# EAGLE design breakout_v3 (EAGLE 9.2.2)
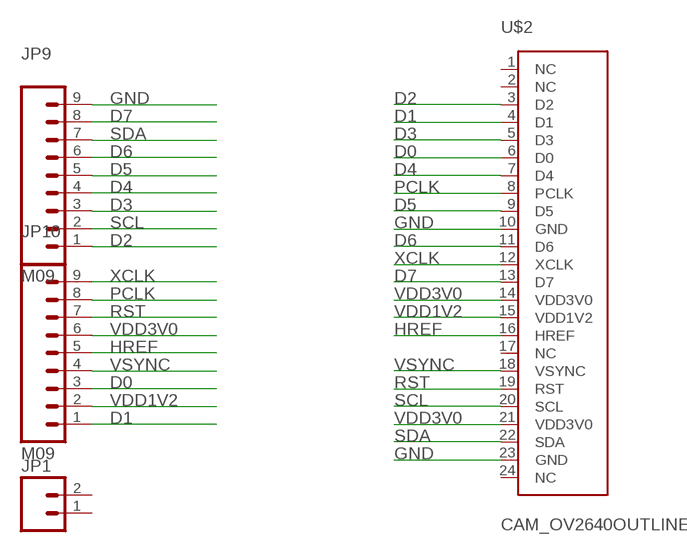
[diagram p0: schematic, sheet 1]

## Parts
JP1  M02PTH  [1X02]
JP9  M09  [1X09]
JP10  M09  [1X09]
U$2  CAM_OV2640OUTLINE  [CAM_CONN]

## Nets
D0: JP10.3 U$2.6(D0)
D1: JP10.1 U$2.4(D1)
D2: JP9.1 U$2.3(D2)
D3: JP9.3 U$2.5(D3)
D4: JP9.4 U$2.7(D4)
D5: JP9.5 U$2.9(D5)
D6: JP9.6 U$2.11(D6)
D7: JP9.8 U$2.13(D7)
GND: JP9.9 U$2.10(GND) U$2.23(GND)
HREF: JP10.5 U$2.16(HREF)
PCLK: JP10.8 U$2.8(PCLK)
RST: JP10.7 U$2.19(RST)
SCL: JP9.2 U$2.20(SCL)
SDA: JP9.7 U$2.22(SDA)
VDD1V2: JP10.2 U$2.15(VDD1V2)
VDD3V0: JP10.6 U$2.14(VDD3V0) U$2.21(VDD3V0)
VSYNC: JP10.4 U$2.18(VSYNC)
XCLK: JP10.9 U$2.12(XCLK)
Unconnected: JP1.1 JP1.2 U$2.1(NC) U$2.2(NC) U$2.17(NC) U$2.24(NC)

## Library data of the parts
JP1 = SparkFun:M02: Header 2 Standard 2-pin 0.1" header. Use with straight break away headers (SKU : PRT-00116), right angle break away headers (PRT-00553), swiss pins (PRT-00743), machine pins (PRT-00117), and female headers (PRT-00115). Molex polarized connector foot print use with SKU : PRT-08233 with associated crimp pins and housings.
JP9 JP10 = SparkFun:M09: Header 9 Standard 9-pin 0.1" header. Use with straight break away headers (SKU : PRT-00116), right angle break away headers (PRT-00553), swiss pins (PRT-00743), machine pins (PRT-00117), and female headers (PRT-00115).
U$2 = Ilya_Teach:CAM_OV2640

## Board
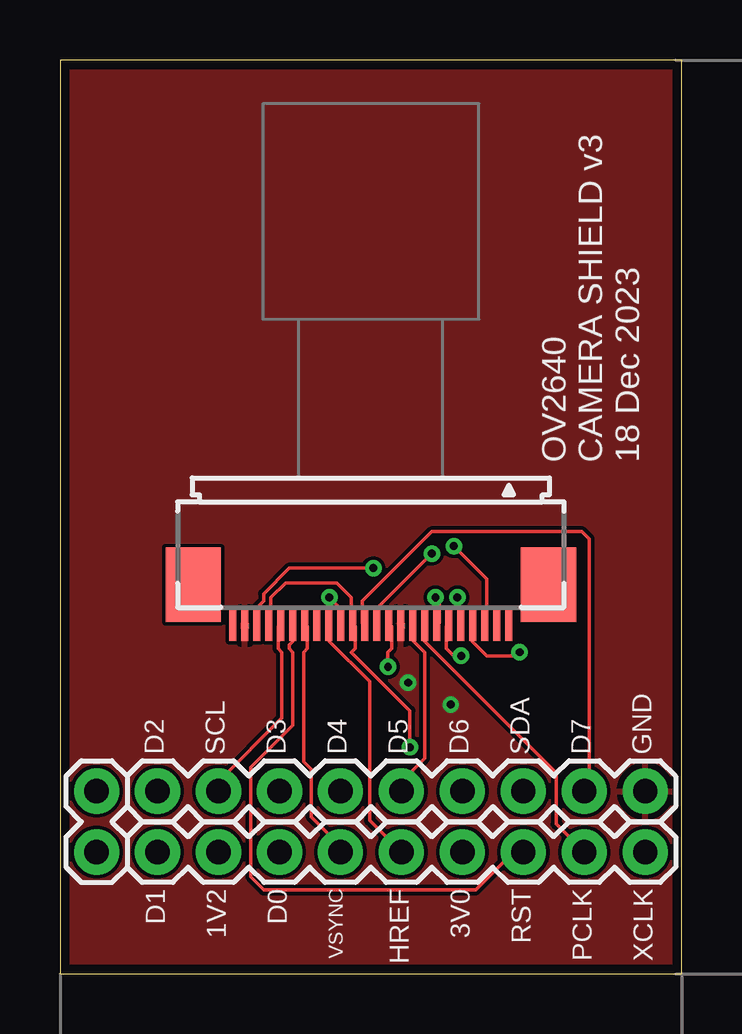
[diagram p1: board, top side]
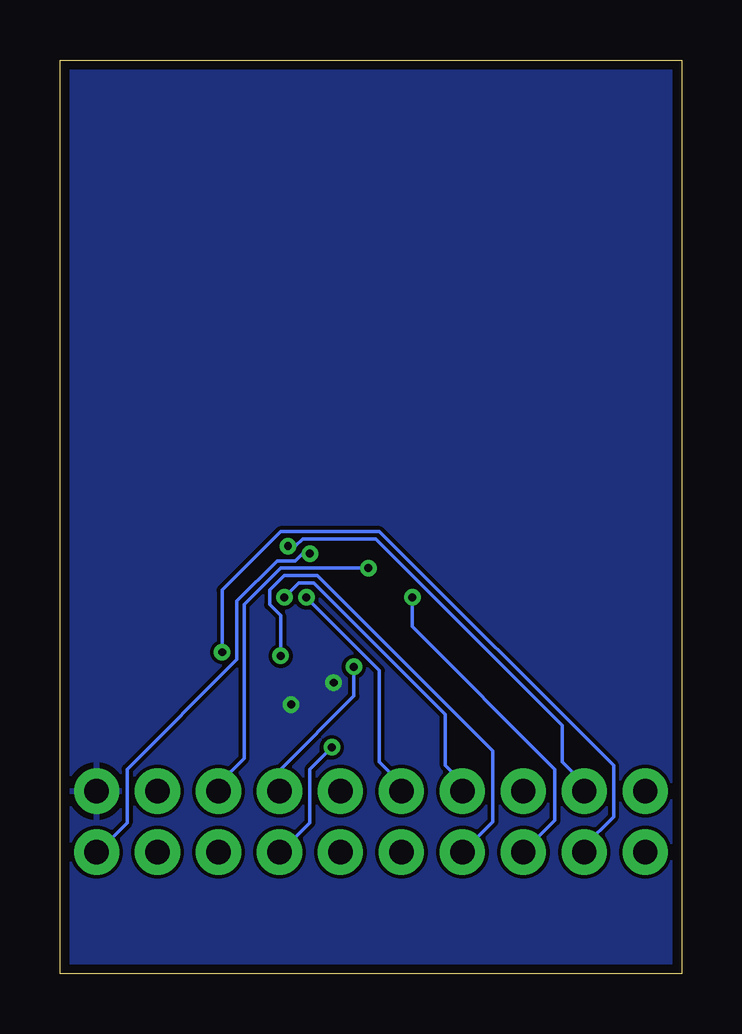
[diagram p2: board, bottom side, seen from below]

Size 25.91 x 38.1 mm. Coordinates in mm from the lower left corner, seen from the top.
Outline: 0,0 25.91,0 25.91,38.1 0,38.1 0,0
Copper layers (1*16): Top 0.0356mm / dielectric 1.5011mm / Bottom 0.0356mm
Design rules "LaenPCBOrder": minimum track width 6mil, minimum drill 13mil, track to track 6mil, track to pad 6mil, pad to pad 6mil, via to via 6mil, smd to smd 6mil, copper to edge 15mil, drill to drill 6mil, minimum pad ring 7mil, minimum via ring 7mil, stop-mask expansion 4mil, vias tented up to drill 0mil, thermal gap 10mil

### Footprints (pad centres in the part's own frame; a part is rotated, then mirrored left to right if it is on the bottom)
1X02 = drill 1.016 pad 1.88: 1 0,0; 2 2.54,0
1X09 = drill 1.016 pad 1.88: 1 0,0; 2 2.54,0; 3 5.08,0; 4 7.62,0; 5 10.16,0; 6 12.7,0; 7 15.24,0; 8 17.78,0; 9 20.32,0
CAM_CONN = smd 0.3 x 1.3: 1 -5.75,3.25; 2 -5.25,3.25; 3 -4.75,3.25; 4 -4.25,3.25; 5 -3.75,3.25; 6 -3.25,3.25; 7 -2.75,3.25; 8 -2.25,3.25; 9 -1.75,3.25; 10 -1.25,3.25; 11 -0.75,3.25; 12 -0.25,3.25; 13 0.25,3.25; 14 0.75,3.25; 15 1.25,3.25; 16 1.75,3.25; 17 2.25,3.25; 18 2.75,3.25; 19 3.25,3.25; 20 3.75,3.25; 21 4.25,3.25; 22 4.75,3.25; 23 5.25,3.25; 24 5.75,3.25 | smd 2.3 x 3.1: P1 -7.4,1.55; P2 7.4,1.55

### Placement (x,y rotation side)
JP1  1.52,5.08 90 top
JP9  4.06,7.62 0 top
JP10  4.06,5.08 0 top
U$2  12.95,17.78 180 top

### Tracks (layer width: path | path; a pad name or v marks a point on that pad's centre or on a via)
D0  (via drill 0.33)
  Top 0.152: v16.71,13.26 16.41,13.26 16.1,13.56 16.1,14.48 U$2.6
  Bottom 0.152: v16.71,13.26 16.71,14.94 17.17,15.39 17.17,16 16.56,16.61 15.19,16.61 7.87,9.3 7.87,6.35 JP10.3
D1  (via drill 0.33)
  Top 0.152: v19.15,13.41 19,13.26 17.78,13.26 17.17,13.87 17.17,14.48 U$2.4
  Bottom 0.152: v19.15,13.41 19.15,16 16.71,18.44 12.6,18.44 2.85,8.69 2.85,6.55 4.06,5.33 JP10.1
D2  (via drill 0.33)
  Top 0.152: v16.41,17.83 17.78,16.46 17.78,14.63 U$2.3
  Bottom 0.152: v16.41,17.83 16.1,17.83 15.8,18.14 12.75,18.14 4.98,10.36 4.98,8.84 4.06,7.92 JP9.1
D3  (via drill 0.33)
  Top 0.152: v16.56,15.7 16.56,15.39 16.71,15.24 16.71,14.63 U$2.5
  Bottom 0.152: v16.56,15.7 15.95,16.31 15.34,16.31 9.86,10.82 9.86,8.69 9.25,8.08 9.25,7.62 JP9.3
D4  (via drill 0.33)
  Top 0.152: v15.65,15.7 15.8,15.54 15.8,14.63 U$2.7
  Bottom 0.152: v15.65,15.7 12.6,12.65 12.6,8.84 11.68,7.92 JP9.4
D5
  Top 0.152: U$2.9 14.73,14.48 14.73,13.87 15.19,13.41 15.19,8.99 14.28,8.08 14.28,7.62 JP9.5
D6  (via drill 0.33)
  Top 0.152: v13.66,12.8 13.66,13.41 13.82,13.56 13.82,14.48 U$2.11
  Bottom 0.152: v13.66,12.8 13.66,11.58 16.71,8.53 16.71,7.62 JP9.6
D7
  Top 0.152: U$2.13 12.6,14.63 12.6,15.54 15.49,18.44 21.74,18.44 22.05,18.14 22.05,7.77 21.89,7.62 JP9.8
GND  (via drill 0.33)
  other vias: 14.5,12.14 16.28,11.23
  pour Top: 0,0 25.91,0 25.91,38.1 0,38.1
  pour Bottom: 0,0 25.91,0 25.91,38.1 0,38.1
HREF
  Top 0.152: U$2.16 11.23,14.48 11.23,13.87 12.9,12.19 12.9,6.4 JP10.5
PCLK
  Top 0.152: U$2.8 15.19,14.48 15.19,13.87 20.68,8.38 20.68,6.25 JP10.8
RST
  Top 0.152: U$2.19 9.7,14.48 9.7,13.87 9.55,13.72 9.55,13.56 9.7,13.41 9.7,10.36 7.95,8.61 7.95,4.04 8.48,3.5 17.32,3.5 18.85,5.03 19.3,5.03 JP10.7
SCL
  Top 0.152: U$2.20 9.09,14.48 9.09,13.56 9.25,13.41 9.25,10.67 6.65,8.08 6.65,7.62 JP9.2
SDA  (via drill 0.33)
  Top 0.152: v13.06,16.92 9.55,16.92 8.48,15.85 8.48,15.54 8.18,15.24 8.18,14.63 U$2.22
  Bottom 0.152: v13.06,16.92 16.71,16.92 18.24,15.39 18.24,8.99 19.3,7.92 JP9.7
VDD1V2  (via drill 0.33)
  Top 0.152: v11.23,15.7 11.68,15.24 11.68,14.63 U$2.15
  Bottom 0.152: v11.23,15.7 11.23,14.48 5.28,8.53 5.28,6.4 JP10.2
VDD3V0  (via drill 0.33)
  Top 0.152: U$2.21 8.79,14.63 8.79,15.7 9.4,16.31 11.53,16.31 12.14,15.7 12.14,14.63 U$2.14 12.29,14.48 12.29,13.56 12.14,13.41 14.58,10.97 v14.58,9.45
  Bottom 0.152: v14.58,9.45 15.49,8.53 15.49,6.3 16.71,5.08 JP10.6
VSYNC
  Top 0.152: JP10.4 11.68,5.33 10.46,6.55 10.46,8.53 10.16,8.84 10.16,13.41 10.31,13.56 10.31,14.48 U$2.18
XCLK  (via drill 0.33)
  Top 0.152: v15.49,17.53 13.21,15.24 13.21,14.63 U$2.12
  Bottom 0.152: v15.49,17.53 15.8,17.53 16.1,17.22 16.87,17.22 18.54,15.54 18.54,13.11 23.11,8.53 23.11,6.3 24.33,5.08 JP10.9

### Text on the board
tPlace: OV2640 / CAMERA SHIELD v3 / 18 Dec 2023 | D2 | SCL | D3 | D4 | D5 | D6 | SDA | D7 | GND | D1 | 1V2 | D0 | VSYNC | HREF | 3V0 | RST | PCLK | XCLK